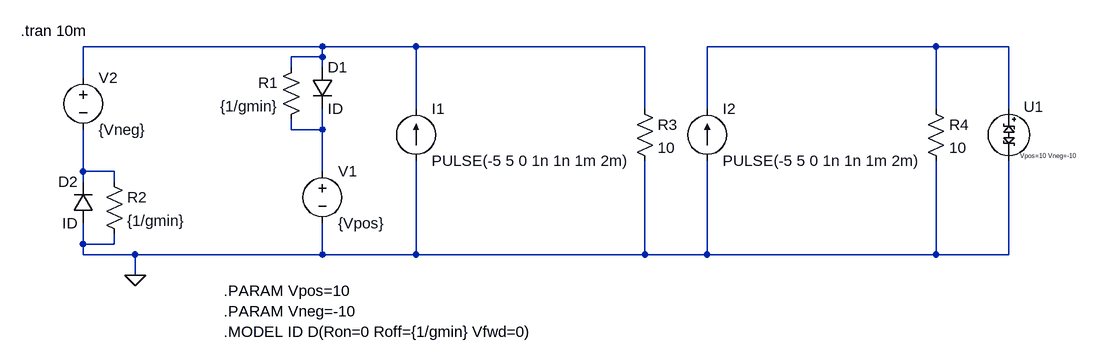
[diagram p0: schematic Vconst.asc]
Vconst.asc, the LTspice schematic file:
Version 4
SHEET 1 1232 680
WIRE 64 32 -304 32
WIRE 208 32 64 32
WIRE 560 32 208 32
WIRE 1008 32 656 32
WIRE 1120 32 1008 32
WIRE 64 48 64 32
WIRE 64 48 16 48
WIRE 16 64 16 48
WIRE 64 64 64 48
WIRE -304 80 -304 32
WIRE 208 128 208 32
WIRE 560 128 560 32
WIRE 656 128 656 32
WIRE 1008 128 1008 32
WIRE 1120 128 1120 32
WIRE 16 160 16 144
WIRE 64 160 64 128
WIRE 64 160 16 160
WIRE -304 224 -304 160
WIRE -256 224 -304 224
WIRE 64 224 64 160
WIRE -304 240 -304 224
WIRE -256 240 -256 224
WIRE -304 336 -304 304
WIRE -256 336 -256 320
WIRE -256 336 -304 336
WIRE -304 352 -304 336
WIRE -224 352 -304 352
WIRE 64 352 64 304
WIRE 64 352 -224 352
WIRE 208 352 208 208
WIRE 208 352 64 352
WIRE 560 352 560 208
WIRE 560 352 208 352
WIRE 656 352 656 208
WIRE 656 352 560 352
WIRE 1008 352 1008 208
WIRE 1008 352 656 352
WIRE 1120 352 1120 208
WIRE 1120 352 1008 352
WIRE -224 384 -224 352
FLAG -224 384 0
SYMBOL current 208 208 M180
WINDOW 0 24 80 Left 2
WINDOW 3 24 0 Left 2
WINDOW 123 0 0 Left 0
WINDOW 39 0 0 Left 0
SYMATTR InstName I1
SYMATTR Value PULSE(-5 5 0 1n 1n 1m 2m)
SYMBOL voltage 64 208 R0
SYMATTR InstName V1
SYMATTR Value {Vpos}
SYMBOL diode 48 64 R0
SYMATTR InstName D1
SYMATTR Value ID
SYMBOL diode -288 304 R180
WINDOW 0 24 64 Left 2
WINDOW 3 24 0 Left 2
SYMATTR InstName D2
SYMATTR Value ID
SYMBOL voltage -304 64 R0
SYMATTR InstName V2
SYMATTR Value {Vneg}
SYMBOL res 544 112 R0
SYMATTR InstName R3
SYMATTR Value 10
SYMBOL res -272 224 R0
SYMATTR InstName R2
SYMATTR Value {1/gmin}
SYMBOL res 32 48 M0
SYMATTR InstName R1
SYMATTR Value {1/gmin}
SYMBOL current 656 208 M180
WINDOW 0 24 80 Left 2
WINDOW 3 24 0 Left 2
WINDOW 123 0 0 Left 0
WINDOW 39 0 0 Left 0
SYMATTR InstName I2
SYMATTR Value PULSE(-5 5 0 1n 1n 1m 2m)
SYMBOL res 992 112 R0
SYMATTR InstName R4
SYMATTR Value 10
SYMBOL Vconst 1120 112 R0
SYMATTR InstName U1
SYMATTR Value2 Vpos=10 Vneg=-10
TEXT -88 408 Left 2 !.PARAM Vpos=10\n.PARAM Vneg=-10\n.MODEL ID D(Ron=0 Roff={1/gmin} Vfwd=0)
TEXT -400 8 Left 2 !.tran 10m

The netlist it stands for:
* Vconst.asc
I1 0 N001 PULSE(-5 5 0 1n 1n 1m 2m)
V1 N003 0 {Vpos}
D1 N001 N003 ID
D2 0 N004 ID
V2 N001 N004 {Vneg}
R3 N001 0 10
R2 N004 0 {1/gmin}
R1 N001 N003 {1/gmin}
I2 0 N002 PULSE(-5 5 0 1n 1n 1m 2m)
R4 N002 0 10
XU1 N002 0 Vconst Vpos=10 Vneg=-10  ; pins 1 2
.model D D
.lib standard.dio
.PARAM Vpos=10
.PARAM Vneg=-10
.MODEL ID D(Ron=0 Roff={1/gmin} Vfwd=0)
.tran 10m
.lib Vconst.lib
.backanno
.end